# EasyEDA Pro project NFC_HackerCard.epro

# Schematic NFCHACKERcard
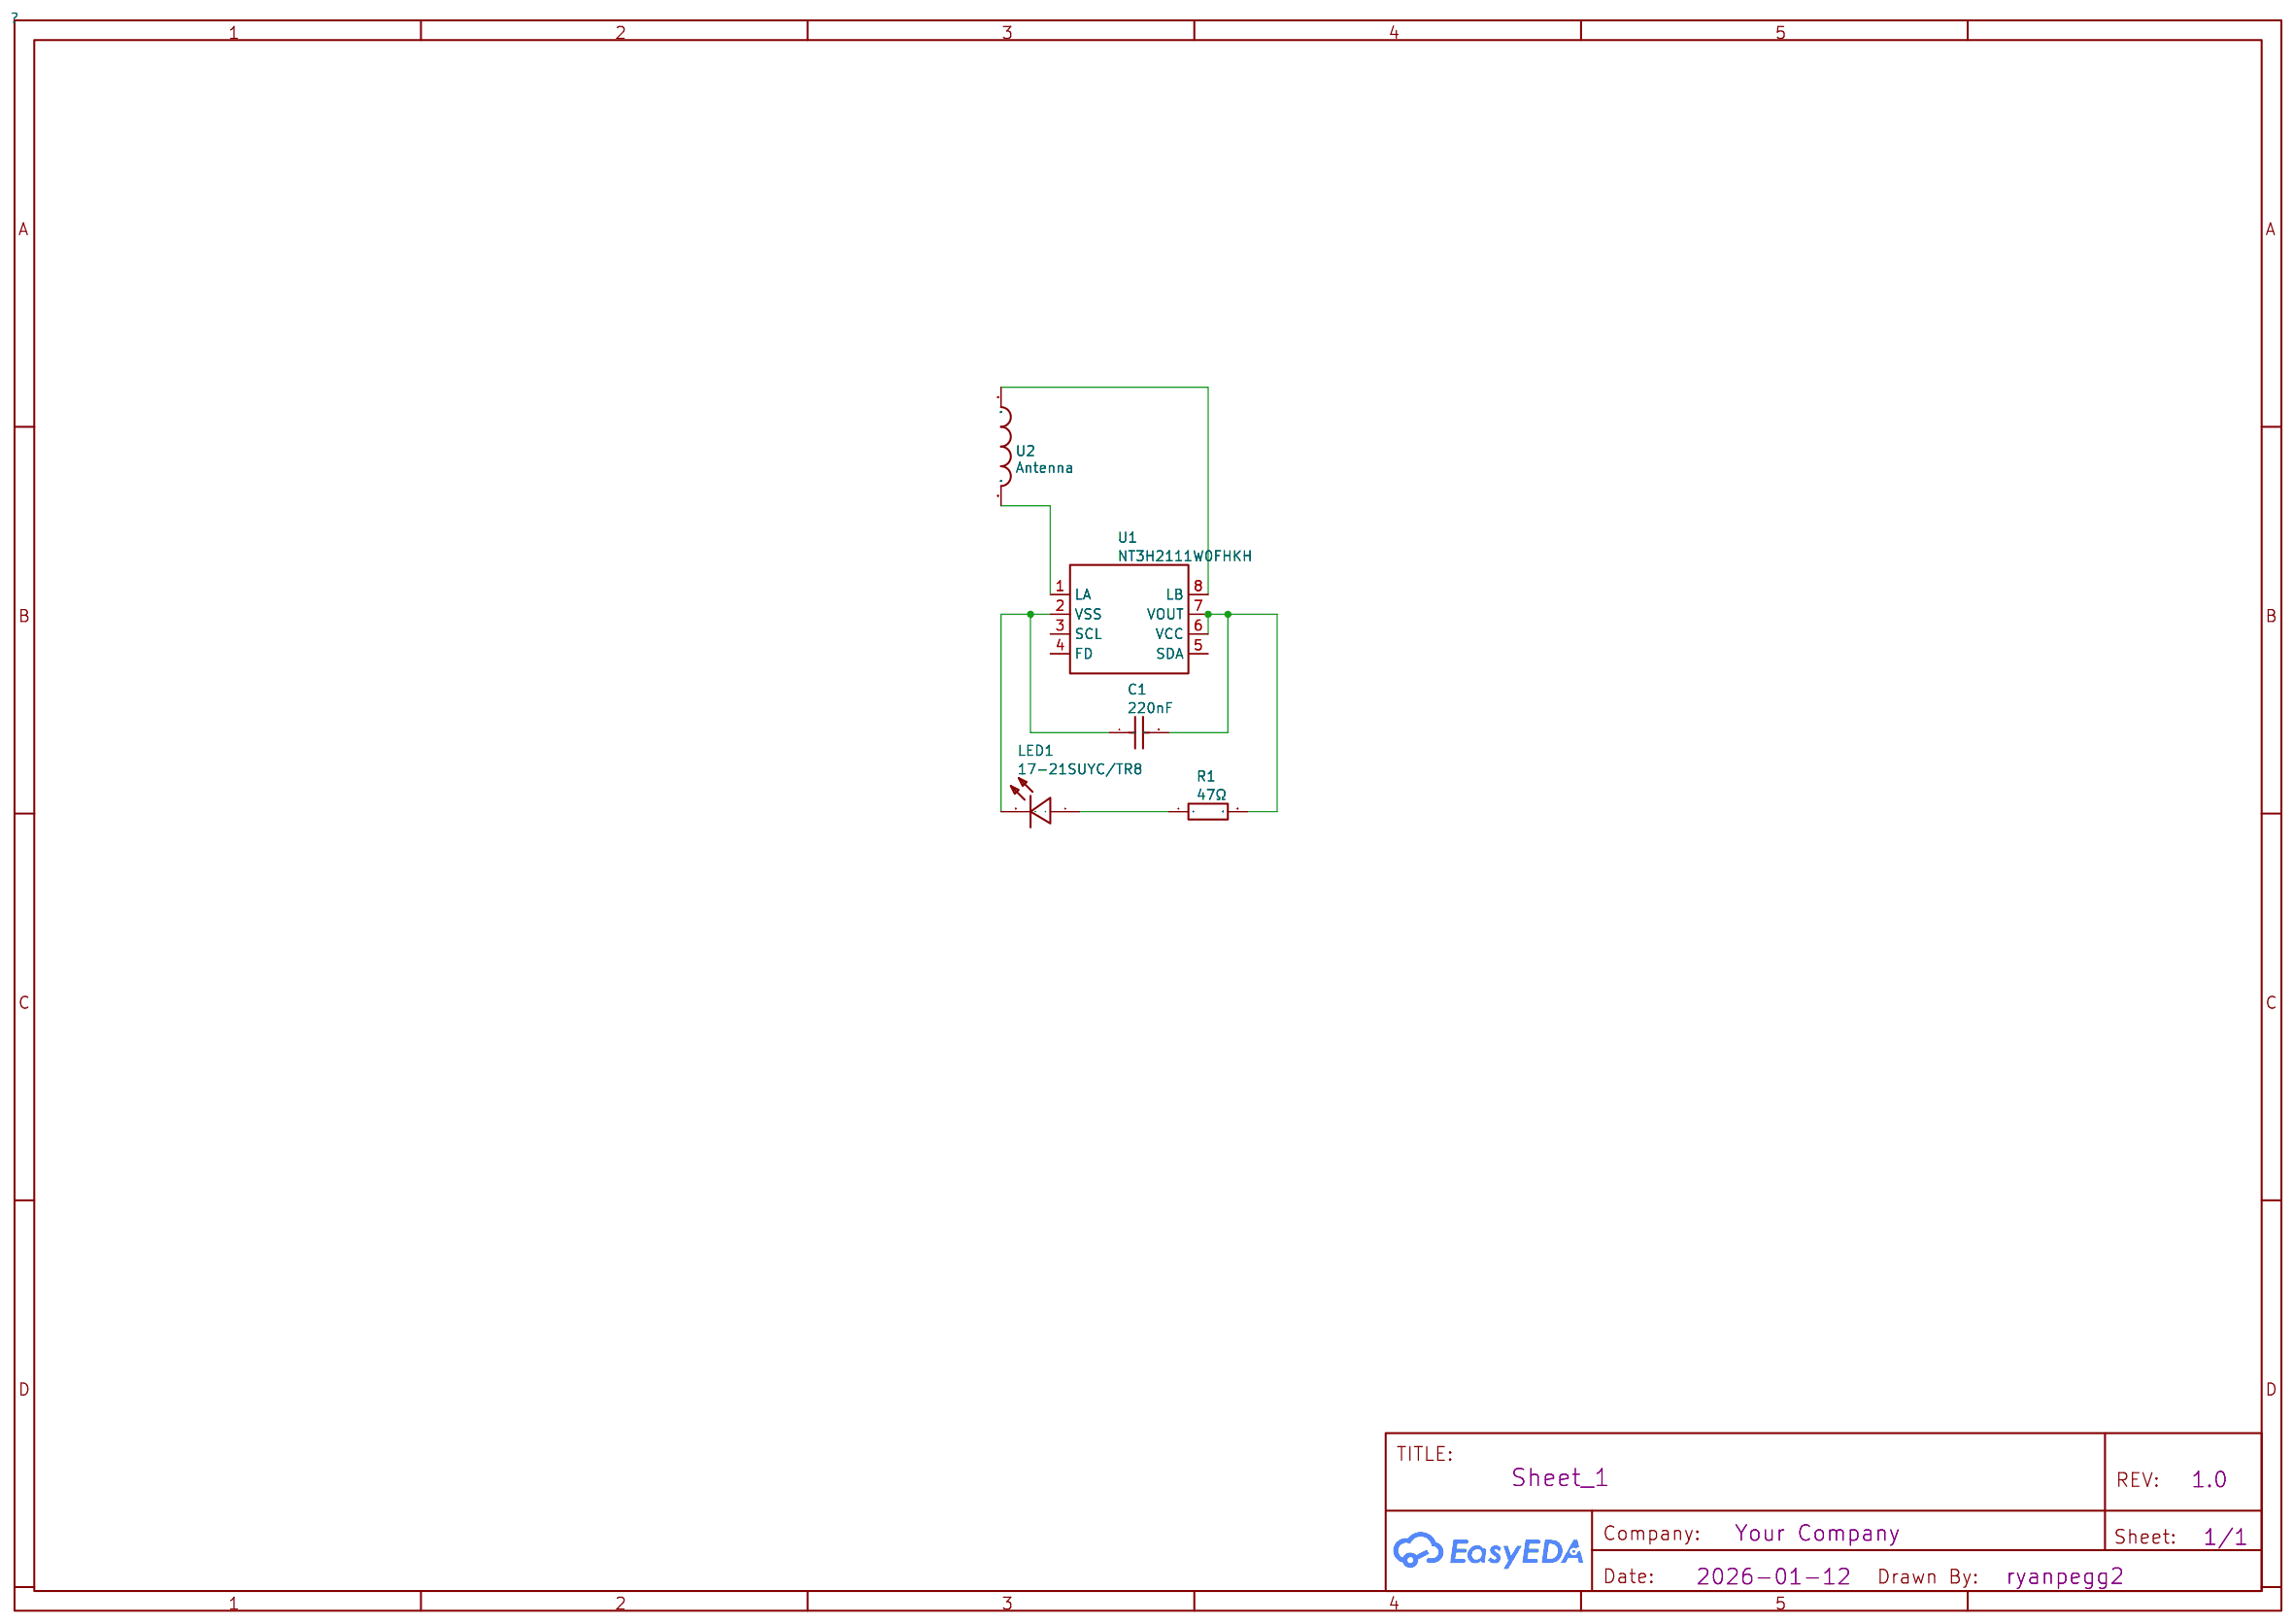
[diagram p0: schematic sheet]

## Parts
C1  220nF  [C0603]
LED1  17-21SUYC/TR8  [LED0805-R-RD]
R1  47Ω  [R0603]
U1  NT3H2111W0FHKH  [XQFN-8_L1.6-W1.6-P0.50-BL_NT3H2111W0FHKH]
U2  Antenna  [25X48MM_NFC_ANTENNA]

## Library data of the parts
C1 = 220nF: Supplier: LCSC; Manufacturer Part: CL10B224KA8NNNC; Manufacturer: SAMSUNG(三星); Supplier Part: C21120; JLCPCB Part Class: Basic Part; nameAlias: Value; spicePre: C; spiceSymbolName: CL10B224KA8NNNC
LED1 = 17-21SUYC/TR8: Supplier: LCSC; Manufacturer: KENTO; Manufacturer Part: KT-0805黄灯; Supplier Part: C2296; JLCPCB Part Class: Basic Part; spicePre: L
R1 = 47Ω: Supplier: LCSC; Manufacturer: UNI-ROYAL(厚声); Manufacturer Part: 0603WAF470JT5E; Supplier Part: C23182; JLCPCB Part Class: Basic Part; nameAlias: Value; spicePre: R; spiceSymbolName: 0603WAF470JT5E
U1 = NT3H2111W0FHKH: Supplier: LCSC; Supplier Part: C710403; Manufacturer: NXP(恩智浦); JLCPCB Part Class: Extended Part; Contributor: LCSC; spicePre: U
U2 = Antenna: Contributor: maggie.j.liu; spicePre: U

## Nets
LED1_1: LED1.1(+) R1.1
U1_1: U1.1(LA) U2.P$1
U1_2: C1.1 LED1.2(-) U1.2(VSS)
U1_7: C1.2 R1.2 U1.6(VCC) U1.7(VOUT)
U1_8: U1.8(LB) U2.P$2

Not connected (* = marked no-connect by the designer): U1 3(SCL) 4(FD) 5(SDA)

# Board PCB_NFCHACKERcard
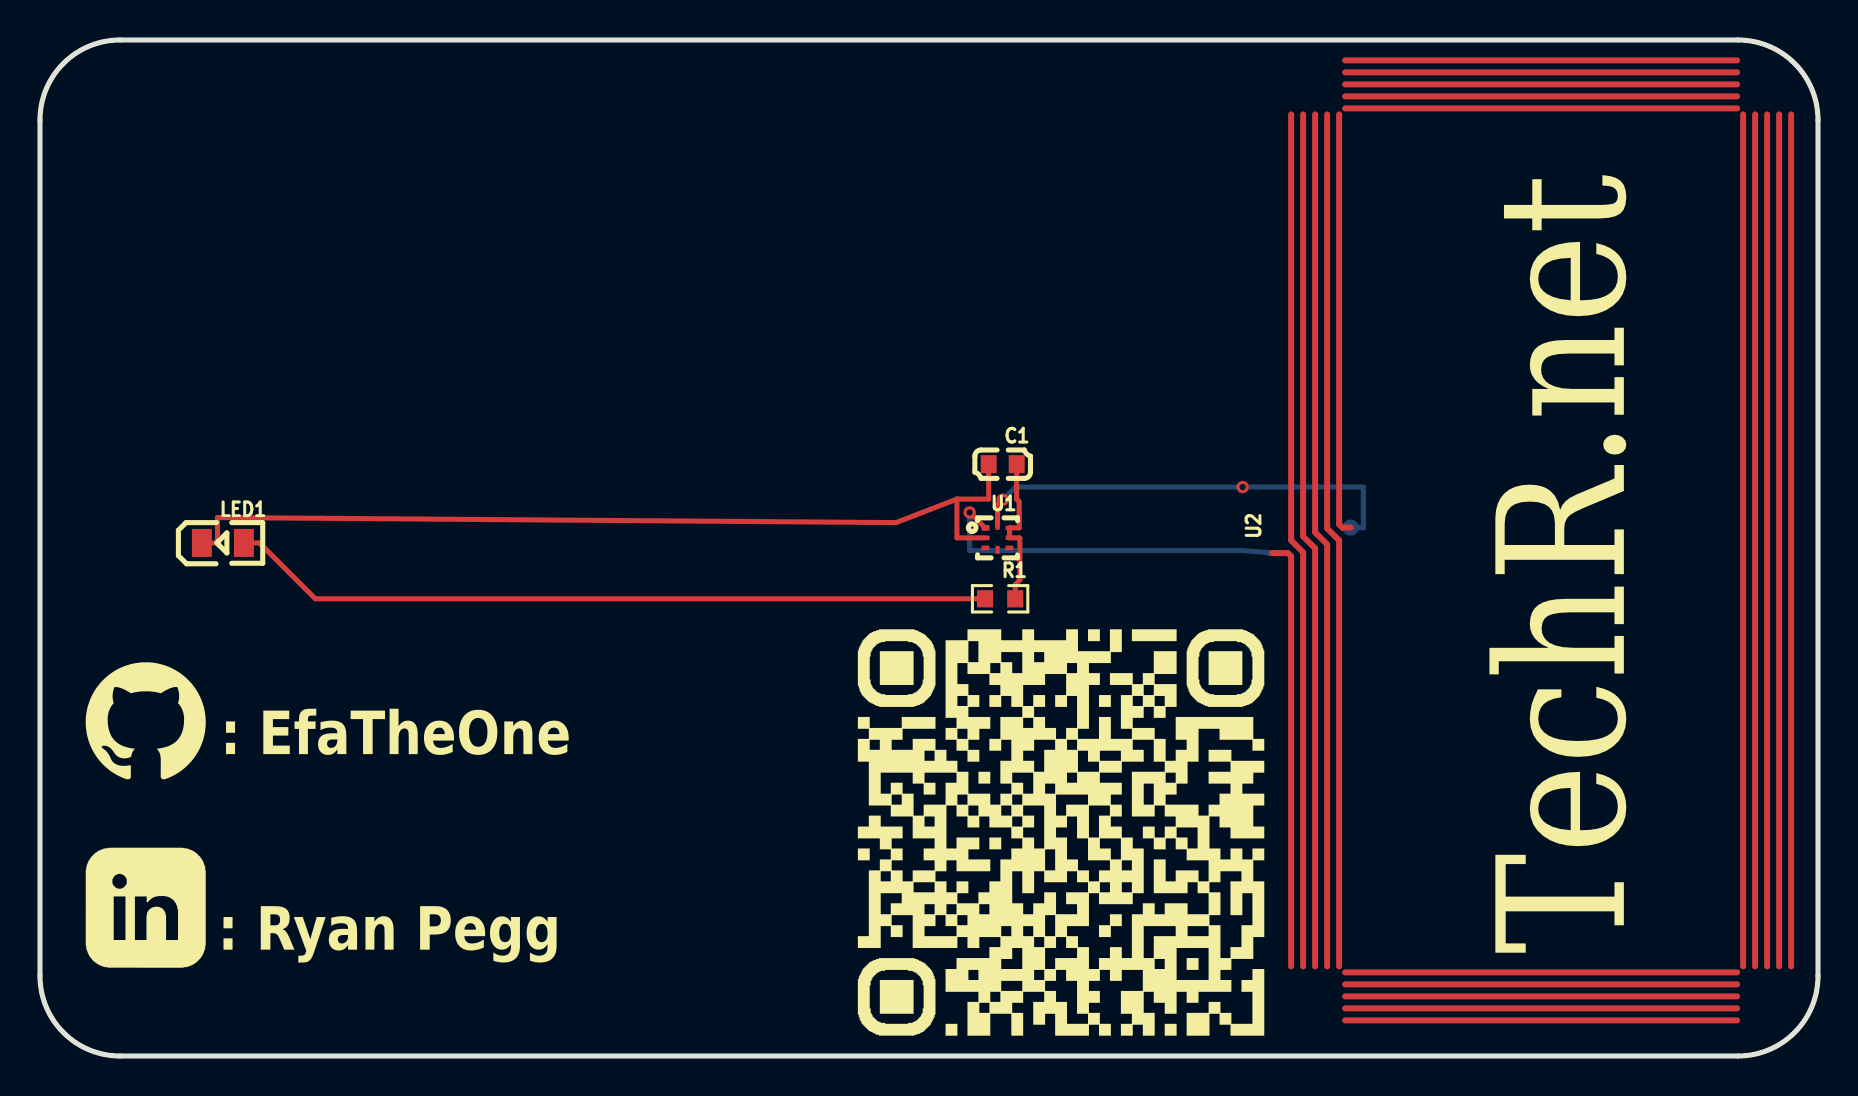
[diagram p1: board, top side]
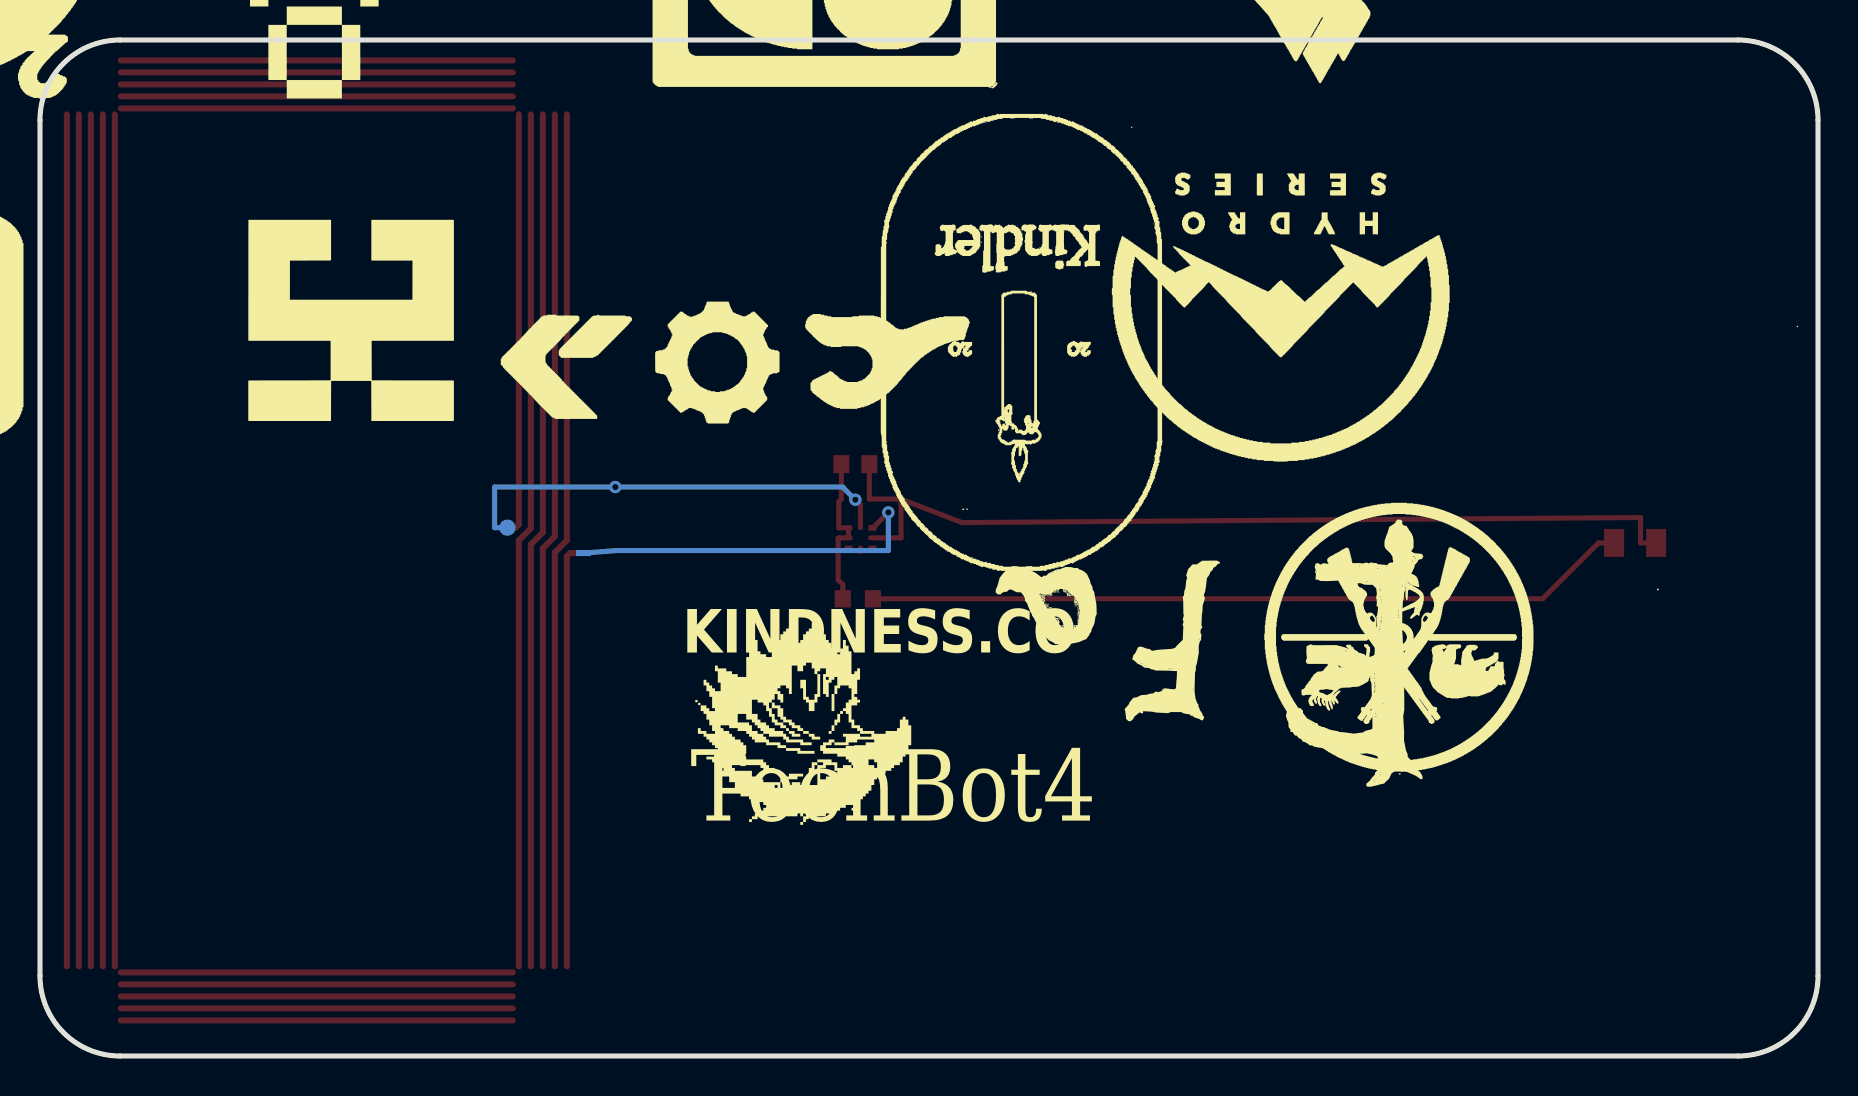
[diagram p2: board, bottom side, seen from below]

Outline 88.9 x 50.8 mm; copper layers: Top Layer, Bottom Layer. Coordinates in mm from the lower left corner of the outline.
Outline path: 0,46.8 arc(1.17,49.63) 4,50.8 84.9,50.8 arc(87.73,49.63) 88.9,46.8 88.9,4 arc(87.73,1.17) 84.9,0 4,0 arc(1.17,1.17) 0,4 0,46.8
Stack: Top Layer 0.035mm / Dielectric1 1.51mm FR4 er 4.5 / Bottom Layer 0.035mm

## Design rules (mm)
spacing Default (default): track to track 0.152, other pairs 0 to 0.152
track width Default (default): min 0.254, default 0.254, max 25.4
differential pair differentialPair (default): width min 0.127, default 0.254, max 2.54; gap min 0.152, default 0.152
via Default (default): diameter min 0.61, default 0.61, max 100.025; hole min 0.305, default 0.305, max 59.995

## Placement (name value [footprint] x y rotation side)
C1  220nF  [C0603]  48.13 29.59 0 top
LED1  17-21SUYC/TR8  [LED0805-R-RD]  9.14 25.65 0 top
R1  47Ω  [R0603]  48.01 22.86 0 top
U1  NT3H2111W0FHKH  [XQFN-8_L1.6-W1.6-P0.50-BL_NT3H2111W0FHKH]  47.88 25.91 0 top
U2  Antenna  [25X48MM_NFC_ANTENNA]  75.06 25.78 90 top

## Footprints (pads in the part's own frame, mm; a bottom-side part is the same pattern mirrored in y, then rotated)
25X48MM_NFC_ANTENNA
  rect 0.3x0.75 smd far side: P$1(-0.635,13.335)
  round 0.808 smd far side: P$2(0.635,9.525)
C0603
  rect 0.8x0.9 smd: 1(-0.7,0) 2(0.7,0)
LED0805-R-RD
  rect 1x1.399 smd: 1(1.05,0) 2(-1.05,0)
R0603
  rect 0.806x0.864 smd: 1(-0.753,0) 2(0.753,0)
XQFN-8_L1.6-W1.6-P0.50-BL_NT3H2111W0FHKH
  rect 0.4x0.28 smd: 1(-0.6,0.5)
  rect 0.4x0.22 smd: 2(-0.6,0) 3(-0.6,-0.5) 5(0.6,-0.5) 6(0.6,0) 7(0.6,0.5)
  rect 0.22x0.4 smd: 4(0,-0.6) 8(0,0.6)

## Nets
As in the schematic.

## Via types
v1: diameter 0.62, hole 0.31, Top Layer to Bottom Layer, 3 vias

## Routing (per net, layer and track width the routed paths; a pad name or vN(x,y) marks a point on that pad's centre or on a via; arc(x,y) is an arc through that point)
LED1_1: length 38.2
  Top Layer w0.254: LED1.1 10.97,25.65 13.77,22.86 R1.1
U1_1: length 18.3
  Top Layer w0.254: U1.1 47.25,26.41 v1(46.48,27.18)
  Bottom Layer w0.254: v1(46.48,27.18) 46.48,25.27 60.07,25.27 U2.P$1
U1_2: length 45.9
  Top Layer w0.254: 8.88,25.65 8.88,26.92 42.8,26.67 45.85,27.85 ; 45.85,27.85 47.43,27.85 47.43,29.59 ; 45.85,27.85 45.85,25.91 U1.2 ; LED1.2 8.87,25.65
U1_7: length 7.9
  Top Layer w0.254: C1.2 48.83,27.85 48.96,27.72 48.96,26.41 48.48,26.41 48.48,25.91 48.96,25.91 48.99,25.87 48.99,23.8 48.76,23.57 R1.2
U1_8: length 22.4
  Top Layer w0.254: U1.8 47.88,27.56 v1(48.13,27.81)
  Bottom Layer w0.254: v1(48.13,27.81) 48.77,28.45 v1(60.13,28.45) 66.17,28.45 66.17,26.42 U2.P$2

## Text on the board
Bottom Silkscreen Layer: KINDNESS.CO | TechBot4
Top Solder Mask Layer: TechRInnovations | ryanpegg2@gmail.com
Top Silkscreen Layer: : Ryan Pegg | : EfaTheOne | TechR.net
